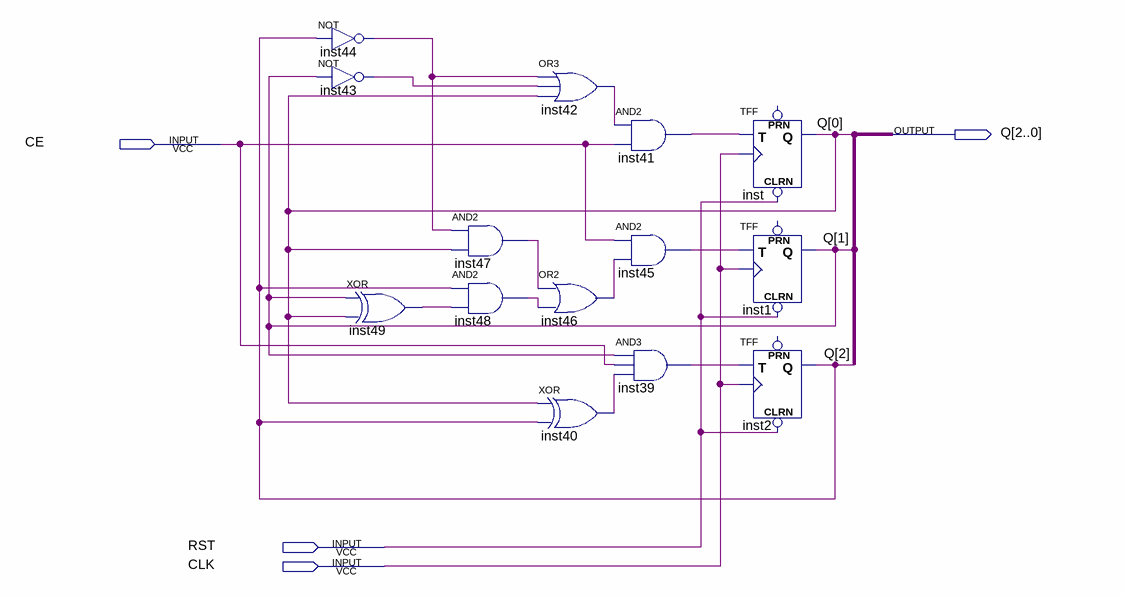
[diagram p0: schematic sheet]
// Quartus schematic Mod7Counter.bdf as structural Verilog: 14 symbols, 4 pins
module Mod7Counter (
  input  CE,
  input  RST,
  input  CLK,
  output [2:0] Q
);

  wire inst39_out, inst40_out, inst41_out, inst42_out, inst43_out, inst44_out, inst45_out, inst46_out,
       inst47_out, inst48_out, inst49_out;

  not inst44 (inst44_out, Q[2]);
  not inst43 (inst43_out, Q[1]);
  xor inst49 (inst49_out, Q[1], Q[0]);
  and inst47 (inst47_out, inst44_out, Q[0]);
  and inst48 (inst48_out, Q[2], inst49_out);
  or inst42 (inst42_out, inst44_out, inst43_out, Q[0]);
  or inst46 (inst46_out, inst47_out, inst48_out);
  xor inst40 (inst40_out, Q[0], Q[2]);
  and inst41 (inst41_out, inst42_out, CE);
  and inst45 (inst45_out, CE, inst46_out);
  and inst39 (inst39_out, Q[1], CE, inst40_out);
  TFF inst (.CLRN(RST), .T(inst41_out), .CLK(CLK), .Q(Q[0]));  // open: PRN
  TFF inst1 (.CLRN(RST), .T(inst45_out), .CLK(CLK), .Q(Q[1]));  // open: PRN
  TFF inst2 (.CLRN(RST), .T(inst39_out), .CLK(CLK), .Q(Q[2]));  // open: PRN
endmodule
